# EAGLE design pomodoro (EAGLE 7.7.0)
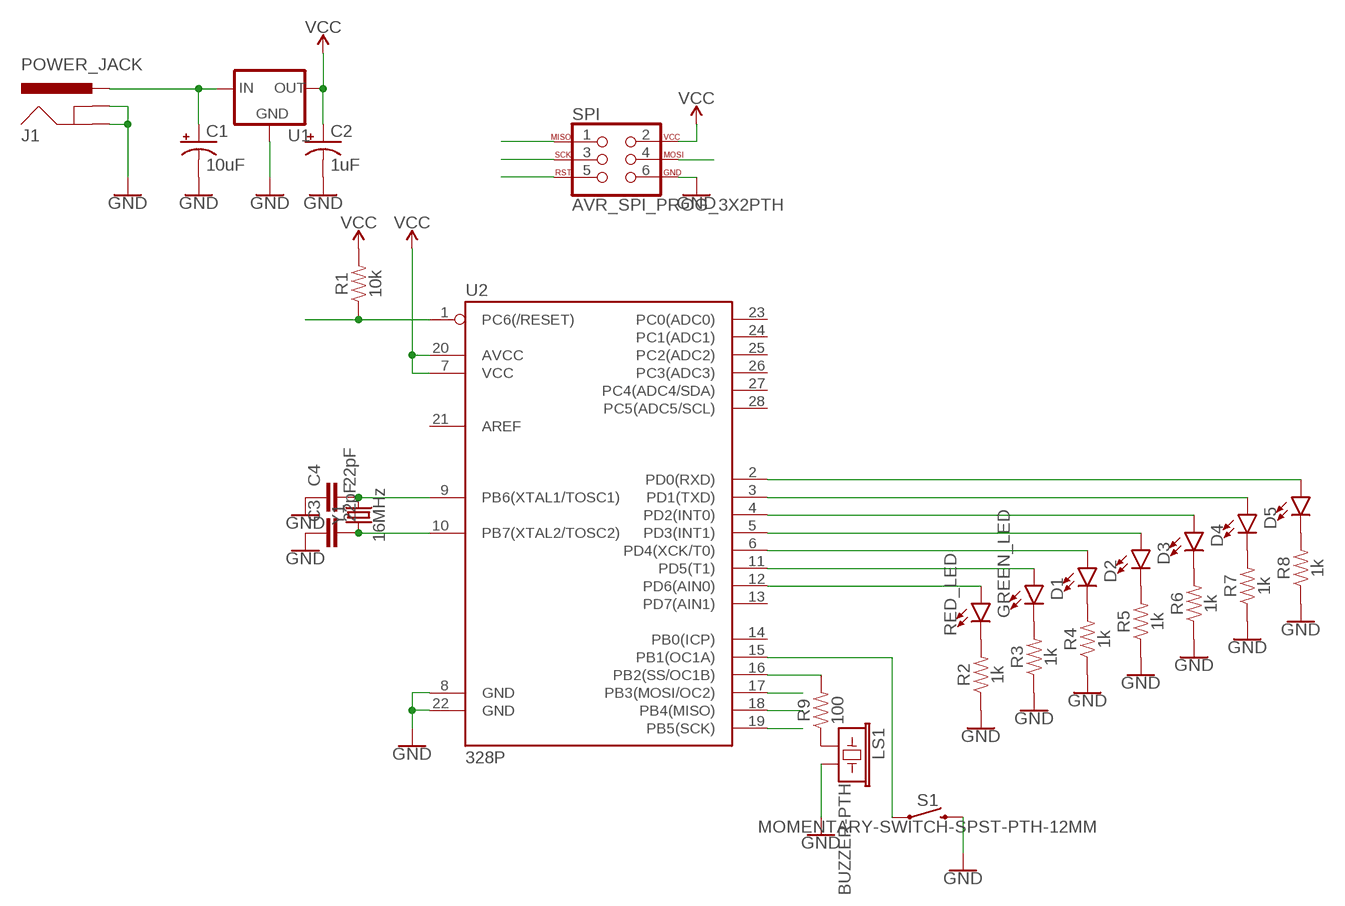
[diagram p0: schematic, sheet 1]

## Parts
C1  10uF  10UF-POLAR-RADIAL-2.5MM-25V-20%  [CPOL-RADIAL-2.5MM-5MM]
C2  1uF  10UF-POLAR-RADIAL-2.5MM-25V-20%  [CPOL-RADIAL-2.5MM-5MM]
C3  22pF  22PF-PTH-2.54MM-200V-5%  [CAP-PTH-2.54]
C4  22pF  22PF-PTH-2.54MM-200V-5%  [CAP-PTH-2.54]
D1  LED5MM  [LED_5MM]
D2  LED5MM  [LED_5MM]
D3  LED5MM  [LED_5MM]
D4  LED5MM  [LED_5MM]
D5  LED5MM  [LED_5MM]
GREEN_LED  LED5MM  [LED_5MM]
J1  POWER_JACK  [POWER_JACK_PTH]
LS1  BUZZER-PTH  [BUZZER-12MM]
R1  10k  1KOHM-HORIZ-1/4W-1%  [AXIAL-0.3]
R2  1k  1KOHM-HORIZ-1/4W-1%  [AXIAL-0.3]
R3  1k  1KOHM-HORIZ-1/4W-1%  [AXIAL-0.3]
R4  1k  1KOHM-HORIZ-1/4W-1%  [AXIAL-0.3]
R5  1k  1KOHM-HORIZ-1/4W-1%  [AXIAL-0.3]
R6  1k  1KOHM-HORIZ-1/4W-1%  [AXIAL-0.3]
R7  1k  1KOHM-HORIZ-1/4W-1%  [AXIAL-0.3]
R8  1k  1KOHM-HORIZ-1/4W-1%  [AXIAL-0.3]
R9  100  1KOHM-HORIZ-1/4W-1%  [AXIAL-0.3]
RED_LED  LED5MM  [LED_5MM]
S1  MOMENTARY-SWITCH-SPST-PTH-12MM  [TACTILE_SWITCH_PTH_12MM]
SPI  AVR_SPI_PROG_3X2PTH  [2X3]
U1  V_REG_78XX-TO-220  [TO-220-ALT]
U2  328P  ATMEGA328P_PDIP  [DIP28]
Y1  16MHz  CRYSTAL-16MHZPTH-HC49US  [HC49US]

## Nets
GND: C1.2(-) C2.2(-) C3.1 C4.1 J1.GND J1.GNDBREAK LS1.- R2.P$1 R3.P$1 R4.P$1 R5.P$1 R6.P$1 R7.P$1 R8.P$1 S1.3 SPI.6 U1.GND U2.8(GND) U2.22(GND)
MISO: SPI.1 U2.18(PB4(MISO))
MOSI: SPI.4 U2.17(PB3(MOSI/OC2))
N$1: R2.P$2 RED_LED.K(C)
N$2: C3.2 U2.10(PB7(XTAL2/TOSC2)) Y1.1
N$3: C4.2 U2.9(PB6(XTAL1/TOSC1)) Y1.2
N$4: GREEN_LED.K(C) R3.P$2
N$5: D1.K(C) R4.P$2
N$6: D2.K(C) R5.P$2
N$7: D3.K(C) R6.P$2
N$8: D4.K(C) R7.P$2
N$9: D5.K(C) R8.P$2
N$10: S1.1 U2.15(PB1(OC1A))
N$11: D5.A U2.2(PD0(RXD))
N$12: D4.A U2.3(PD1(TXD))
N$13: D3.A U2.4(PD2(INT0))
N$14: D2.A U2.5(PD3(INT1))
N$15: D1.A U2.6(PD4(XCK/T0))
N$16: GREEN_LED.A U2.11(PD5(T1))
N$17: RED_LED.A U2.12(PD6(AIN0))
N$18: R9.P$2 U2.16(PB2(SS/OC1B))
N$19: C1.1(+) J1.PWR U1.IN
N$20: LS1.+ R9.P$1
RST: R1.P$1 SPI.5 U2.1(PC6(/RESET))
SCK: SPI.3 U2.19(PB5(SCK))
VCC: C2.1(+) R1.P$2 SPI.2 U1.OUT U2.7(VCC) U2.20(AVCC)
Unconnected: U2.13(PD7(AIN1)) U2.14(PB0(ICP)) U2.21(AREF) U2.23(PC0(ADC0)) U2.24(PC1(ADC1)) U2.25(PC2(ADC2)) U2.26(PC3(ADC3)) U2.27(PC4(ADC4/SDA)) U2.28(PC5(ADC5/SCL))

## Library data of the parts
C1 = SparkFun-Capacitors:10UF-POLAR: 10.0µF polarized capacitors A capacitor is a passive two-terminal electrical component used to store electrical energy temporarily in an electric field.; PROD_ID: CAP-08440
C2 = SparkFun-Capacitors:10UF-POLAR: 10.0µF polarized capacitors A capacitor is a passive two-terminal electrical component used to store electrical energy temporarily in an electric field.; PROD_ID: CAP-08440; VALUE: 10uF
C3 C4 = SparkFun-Capacitors:22PF: 22pF ceramic capacitors A capacitor is a passive two-terminal electrical component used to store electrical energy temporarily in an electric field.; PROD_ID: CAP-09128
D1-D5 GREEN_LED RED_LED = SparkFun-LED:LED: LED (Generic) Standard schematic elements and footprints for 5mm, 3mm, 1206, and 0603 sized LEDs. Generic LEDs with no color specified.
J1 = SparkFun-Connectors:POWER_JACK: Power Jack Connector This is the standard 5.5mm barrel jack for power. The PTH is the most common, proven, reliable, footprint. The Slot footprint only works if the mill layer is transmitted to the PCB fab house so be warned. Here are the connectors we sell at SparkFun: DC Barrel Power Jack/Connector <https://www.sparkfun.com/products/119> (PRT-00119) DC Barrel Power Jack/Connector (SMD) <https://www.sparkfun.com/products/12748> (PRT-12748) DC Barrel Jack Adapter - Breadboard Compatible <https://www.sparkfun.com/products/10811> (PRT-10811) It is used on this SparkFun product (and many, many others): SparkFun RedBoard - Programmed with Arduino <https://www.sparkfun.com/products/12757> (DEV-12757) Also, if you need a mating power supply or connector, please check these out: Wall Adapter Power Supply - 9VDC 650mA <https://www.sparkfun.com/products/298> (TOL-00298) DC Barrel Jack Adapter - Male <https://www.sparkfun.com/products/10287> (PRT-10287); PROD_ID: CONN-08197
LS1 = SparkFun-Electromechanical:BUZZER: Buzzer Small round buzzers that operate around the audible 2kHz range. You can use these as speakers to create simple music or user interfaces. Variant Overview: PTH - Mini Speaker - PC Mount 12mm 2.048kHz <https://www.sparkfun.com/products/7950> PTH_KIT - Mini Speaker - PC Mount 12mm 2.048kHz <https://www.sparkfun.com/products/7950> KIT simplifies soldering by adding stop mask to one side of the pads. PTH_NO_SILK - Mini Speaker - PC Mount 12mm 2.048kHz <https://www.sparkfun.com/products/7950> No silkscreen indicator of buzzer outline. PTH_KIT_NO_SILK - Mini Speaker - PC Mount 12mm 2.048kHz <https://www.sparkfun.com/products/7950> KIT package w/o silkscreen SMD - Buzzer Audio Magnetic (CCV-084B16) SMD buzzer used on, e.g. the LilyPad Buzzer <https://www.sparkfun.com/products/8463> and RFID USB Reader <https://www.sparkfun.com/products/9963>. SMD_KIT - Buzzer Audio Magnetic (CCV-084B16) SMD Buzzer with elongated pins to make soldering easier. Used on the SparkFun Simon Says - Surface Mount Soldering Kit <https://www.sparkfun.com/products/10935>.; PROD_ID: COMP-08253; SF_SKU: COM-07950
R1 R9 = SparkFun-Resistors:1KOHM: 1kΩ resistor A resistor is a passive two-terminal electrical component that implements electrical resistance as a circuit element. Resistors act to reduce current flow, and, at the same time, act to lower voltage levels within circuits. - Wikipedia; PROD_ID: RES-12182; VALUE: 1k
R2-R8 = SparkFun-Resistors:1KOHM: 1kΩ resistor A resistor is a passive two-terminal electrical component that implements electrical resistance as a circuit element. Resistors act to reduce current flow, and, at the same time, act to lower voltage levels within circuits. - Wikipedia; PROD_ID: RES-12182
S1 = SparkFun-Switches:MOMENTARY-SWITCH-SPST: Momentary Switch (Pushbutton) - SPST Normally-open (NO) SPST momentary switches (buttons, pushbuttons). Variants PTH-12MM - 12mm square, through-hole Momentary Pushbutton Switch - 12mm Square <https://www.sparkfun.com/products/9190> (COM-09190) PTH-6.0MM, PTH-6.0MM-KIT - 6.0mm square, through-hole Mini Pushbutton Switch <https://www.sparkfun.com/products/97> (COM-00097) KIT package intended for soldering kit's - only one side of pads' copper is exposed. PTH-RIGHT-ANGLE-KIT - Right-angle, through-hole Right Angle Tactile Button <https://www.sparkfun.com/products/10791> - Used on SparkFun BigTime Watch Kit <https://www.sparkfun.com/products/11734> SMD-12MM - 12mm square, surface-mount Tactile Button - SMD (12mm) <https://www.sparkfun.com/products/12993> (COM-12993) Used on SparkFun PicoBoard <https://www.sparkfun.com/products/11888> SMD-4.5MM - 4.5mm Square Trackball Switch Used on SparkFun Blackberry Trackballer Breakout <https://www.sparkfun.com/products/13169> SMD-4.6MMX2.8MM - 4.60mm x 2.80mm, surface mount Used on SparkFun SAMD21 Mini Breakout <https://www.sparkfun.com/products/13664> SMD-5.2MM, SMD-5.2-REDUNDANT - 5.2mm square, surface-mount Mini Pushbutton Switch - SMD <https://www.sparkfun.com/products/8720> (COM-08720) Used on Arduino Pro Mini <https://www.sparkfun.com/products/11114> REDUNDANT package connects both switch circuits together SMD-6.0X3.5MM - 6.0 x 3.5mm, surface mount Momentary Reset Switch SMD <https://www.sparkfun.com/products/8229> (COM-08229) SMD-6.2MM-TALL - 6.2mm square, surface mount Tactile Button - SMD (6mm) <https://www.sparkfun.com/products/12992> Used on SparkFun Digital Sandbox <https://www.sparkfun.com/products/12651> SMD-RIGHT-ANGLE - Right-angle, surface mount Used on SparkFun Block for Intel® Edison - Arduino <https://www.sparkfun.com/products/13036>; PROD_ID: SWCH-09185; SF_SKU: COM-09190
SPI = SparkFun-Connectors:AVR_SPI_PROG_3X2: AVR ISP 6 Pin This is the reduced ISP connector for AVR programming. Common on Arduino. This footprint will take up less PCB space and can be used with a 10-pin to 6-pin adapter such as SKU: BOB-08508 **Special note about "TEST_POINT" package. The stop mask is on the top side, so if you want your programming test points to be on the bottom of your board, make sure to place this package on the bottom side of the board. This also ensure that the orientation to program from the bottom side will be correct. SparkFun Products: SparkFun ISP Pogo Adapter <https://www.sparkfun.com/products/11591> - NS Tiny AVR Programmer <https://www.sparkfun.com/products/11801> -PTH
U1 = SparkFun-IC-Power:V_REG_78XX: Voltage Regulator Standard 78xx regulator. IGO (Input Ground Output). Spark Fun Electronics SKU : COM-00107; PROD_ID: VREG-08450; SF_ID: COM-00107
U2 = SparkFun-IC-Microcontroller:ATMEGA328P_PDIP: Atmel 328P Through hole ATMEGA328P uC used in the Arduino 32kb flash, 1k EEPROM, 2k SRAM Datasheet <http://www.sparkfun.com/datasheets/Components/SMD/ATMega328.pdf> SparkFun Products Storefront component: AVR 28 Pin 20MHz 32K 6A/D - ATMega328P <https://www.sparkfun.com/products/9061> (COM-09061) SparkFun Simon Says - Through-Hole Soldering Kit <https://www.sparkfun.com/products/10547> (KIT-10547) SparkFun Learn to Solder - Simon Says <https://www.sparkfun.com/products/13708> (KIT-13708) SparkFun BigTime Watch Kit <https://www.sparkfun.com/products/11734> (KIT-11734) SparkFun ClockIt <https://www.sparkfun.com/products/10930> (KIT-10930) SparkFun Serial Enabled LCD Kit <https://www.sparkfun.com/products/10097> (LCD-10097) SparkFun Simon Tilts - Through Hole Soldering Kit <https://www.sparkfun.com/products/12634> (KIT-12634) SparkFun Frequency Counter Kit <https://www.sparkfun.com/products/10140> (KIT-10140) FabFM Radio Kit <https://www.sparkfun.com/products/11043> (KIT-11043) SparkFun Binary Blaster Kit <https://www.sparkfun.com/products/12037> (KIT-12037) SparkFun Metro-Gnome <https://www.sparkfun.com/products/9236> (KIT-09236) ATmega328 with Arduino Optiboot (Uno) <https://www.sparkfun.com/products/10524> (DEV-10524); PROD_ID: IC-09136
Y1 = SparkFun-Clocks:CRYSTAL-16MHZ: 16MHz Crystal Digikey Example <http://www.digikey.com/product-search/en?keywords=535-9122-1-ND> Frequency: 16MHz Frequency Stability: ±50ppm Frequency Tolerance: ±20ppm Load Capacitance: 18pF SparkFun Products: Pro Micro -5V/16MHz <https://www.sparkfun.com/products/12640> SparkFun Serial Enabled LCD Kit <https://www.sparkfun.com/products/10097>; PROD_ID: XTAL-08181; SF_ID: COM-00536

## Board
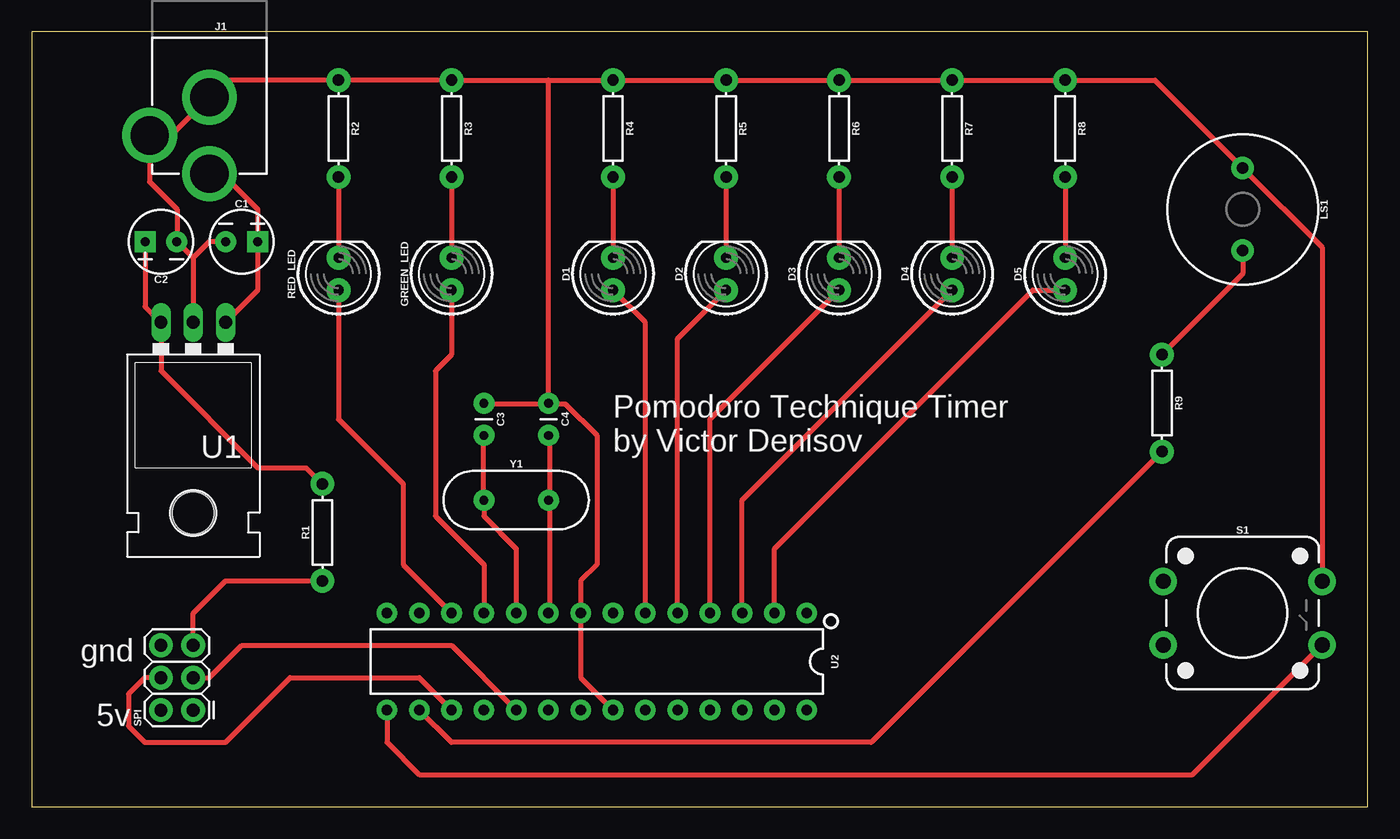
[diagram p1: board, top side]
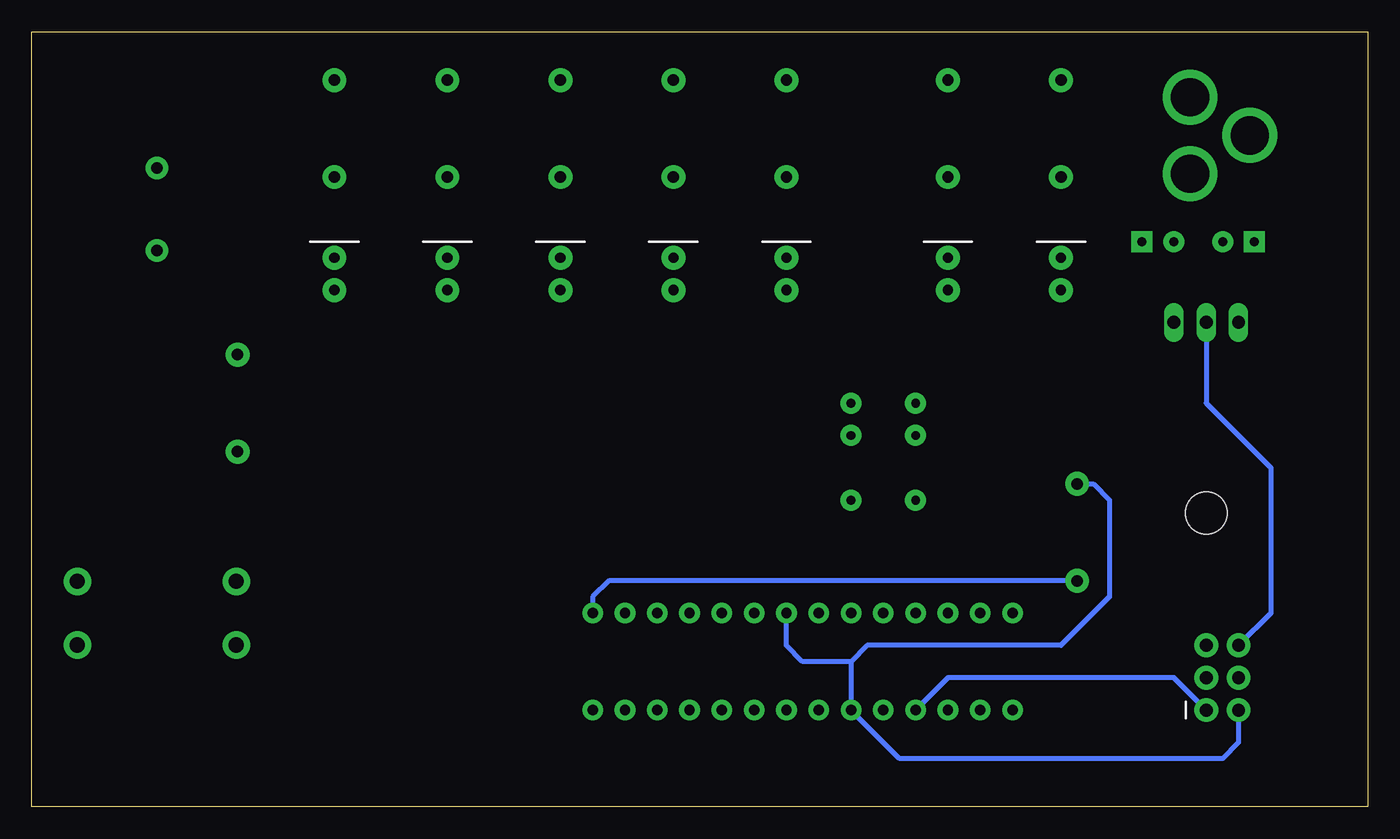
[diagram p2: board, bottom side, seen from below]

Size 105.08 x 60.95 mm. Coordinates in mm from the lower left corner, seen from the top.
Outline: 0,0 105.08,0 105.08,60.95 0,60.95 0,0
Copper layers (1*16): Top 0.035mm / dielectric 1.5mm / Bottom 0.035mm
Design rules "default": minimum track width 10mil, minimum drill 24mil, track to track 8mil, track to pad 8mil, pad to pad 8mil, via to via 8mil, smd to smd 8mil, copper to edge 40mil, drill to drill 8mil, minimum pad ring 10mil, minimum via ring 8mil, stop-mask expansion 4mil, vias tented up to drill 0mil, thermal gap 10mil

### Footprints (pad centres in the part's own frame; a part is rotated, then mirrored left to right if it is on the bottom)
CPOL-RADIAL-2.5MM-5MM = drill 0.7 pad 1.651 square: 1 1.25,0 | drill 0.7 pad 1.651: 2 -1.25,0
CAP-PTH-2.54 = drill 0.7 pad 1.651: 1 -1.27,0; 2 1.27,0
LED_5MM = drill 0.813 pad 1.88: A -1.27,0; K 1.27,0
POWER_JACK_PTH = drill 2.997 pad 4.318: GND 0,7.7; GNDBREAK 4.7,10.7; PWR 0,13.7
BUZZER-12MM = drill 0.9 pad 1.778: + 3.25,0; - -3.25,0
AXIAL-0.3 = drill 0.9 pad 1.88: P$1 -3.81,0; P$2 3.81,0
TACTILE_SWITCH_PTH_12MM = drill 1.2 pad 2.159: 1 6.25,-2.5; 2 -6.25,-2.5; 3 6.25,2.5; 4 -6.25,2.5
2X3 = drill 1.016 pad 1.88: 1 0,0; 2 0,2.54; 3 2.54,0; 4 2.54,2.54; 5 5.08,0; 6 5.08,2.54
TO-220-ALT = drill 1.016 long: GND 0,-3.81; IN -2.54,-3.81; OUT 2.54,-3.81 | hole 3.302: 0,11.176
DIP28 = drill 0.813 pad 1.626: 1 -16.51,-3.81; 2 -13.97,-3.81; 3 -11.43,-3.81; 4 -8.89,-3.81; 5 -6.35,-3.81; 6 -3.81,-3.81; 7 -1.27,-3.81; 8 1.27,-3.81; 9 3.81,-3.81; 10 6.35,-3.81; 11 8.89,-3.81; 12 11.43,-3.81; 13 13.97,-3.81; 14 16.51,-3.81; 15 16.51,3.81; 16 13.97,3.81; 17 11.43,3.81; 18 8.89,3.81; 19 6.35,3.81; 20 3.81,3.81; 21 1.27,3.81; 22 -1.27,3.81; 23 -3.81,3.81; 24 -6.35,3.81; 25 -8.89,3.81; 26 -11.43,3.81; 27 -13.97,3.81; 28 -16.51,3.81
HC49US = drill 0.7 pad 1.651: 1 -2.54,0; 2 2.54,0

### Placement (x,y rotation side)
C1  16.51,44.45 0 top
C2  10.16,44.45 180 top
C3  35.56,30.48 270 top
C4  40.64,30.48 270 top
D1  45.72,41.91 90 top
D2  54.61,41.91 90 top
D3  63.5,41.91 90 top
D4  72.39,41.91 90 top
D5  81.28,41.91 90 top
GREEN_LED  33.02,41.91 90 top
J1  13.97,63.5 180 top
LS1  95.25,46.99 270 top
R1  22.86,21.59 90 top
R2  24.13,53.34 270 top
R3  33.02,53.34 270 top
R4  45.72,53.34 270 top
R5  54.61,53.34 270 top
R6  63.5,53.34 270 top
R7  72.39,53.34 270 top
R8  81.28,53.34 270 top
R9  88.9,31.75 270 top
RED_LED  24.13,41.91 90 top
S1  95.25,15.24 0 top
SPI  12.7,7.62 90 top
U1  12.7,34.29 180 top
U2  44.45,11.43 180 top
Y1  38.1,24.13 0 top

### Tracks (layer width: path | path; a pad name or v marks a point on that pad's centre or on a via)
GND
  Top 0.254: 35.71,31.7 C3.1 35.48,31.93 | 40.51,31.7 C4.1 | 13.77,55.7 J1.GND | 11.25,44.5 C2.2
  Top 0.406: 40.51,31.7 41.96,31.7 44.45,29.21 44.45,19.05 43.18,17.78 U2.8 43.18,10.16 U2.22 | 40.64,57.15 R3.P$1 R2.P$1 15.32,57.15 J1.GND 10.97,52.8 J1.GNDBREAK 9.27,49.15 11.43,46.99 11.43,44.47 C2.2 11.43,44.45 12.7,43.18 | 40.64,57.15 R4.P$1 R5.P$1 R6.P$1 R7.P$1 R8.P$1 88.34,57.15 LS1.- 101.5,43.99 S1.3 | 40.64,57.15 C4.1 40.59,31.7 35.71,31.7 | 12.7,43.18 U1.GND | C1.2 13.97,44.45 12.7,43.18
  Bottom 0.406: U1.GND 12.7,31.75 7.62,26.67 7.62,15.24 SPI.6
MISO
  Bottom 0.406: SPI.1 15.24,10.16 33.02,10.16 U2.18
MOSI
  Top 0.406: SPI.4 8.89,10.16 7.62,8.89 7.62,6.35 8.89,5.08 15.24,5.08 20.32,10.16 30.48,10.16 U2.17
N$1
  Top 0.406: R2.P$2 RED_LED.K
N$2
  Top 0.254: 35.48,29.18 C3.2 | 35.48,24.15 Y1.1
  Top 0.406: U2.10 38.1,20.32 35.56,22.86 Y1.1 35.48,24.21 35.48,29.18
N$3
  Top 0.254: 40.74,15.24 U2.9 | 40.74,23.93 Y1.2 40.74,24.15 | 40.74,29.18 C4.2
  Top 0.406: 40.74,23.93 40.74,15.34 U2.9 | 40.74,29.18 40.74,24.23 Y1.2
N$4
  Top 0.406: R3.P$2 GREEN_LED.K
N$5
  Top 0.406: R4.P$2 D1.K
N$6
  Top 0.406: R5.P$2 D2.K
N$7
  Top 0.406: R6.P$2 D3.K
N$8
  Top 0.406: R7.P$2 D4.K
N$9
  Top 0.406: R8.P$2 D5.K
N$10
  Top 0.406: U2.15 27.94,5.08 30.48,2.54 91.3,2.54 S1.1
N$11
  Top 0.406: U2.2 58.42,20.32 78.74,40.64 D5.A
N$12
  Top 0.406: U2.3 55.88,24.13 D4.A
N$13
  Top 0.406: U2.4 53.34,30.48 D3.A
N$14
  Top 0.406: U2.5 50.8,36.83 D2.A
N$15
  Top 0.406: U2.6 48.26,38.1 D1.A
N$16
  Top 0.406: GREEN_LED.A 33.02,35.56 31.75,34.29 31.75,22.86 35.56,19.05 U2.11
N$17
  Top 0.406: RED_LED.A 24.13,30.48 29.21,25.4 29.21,19.05 U2.12
N$18
  Top 0.406: R9.P$2 66.04,5.08 33.02,5.08 U2.16
N$19
  Top 0.406: J1.PWR 14.97,49.8 17.78,46.99 17.78,44.47 C1.1 17.76,40.62 U1.IN
N$20
  Top 0.406: LS1.+ 95.25,41.91 R9.P$1
RST
  Top 0.406: SPI.5 12.7,15.24 15.24,17.78 R1.P$1
  Bottom 0.406: R1.P$1 59.69,17.78 60.96,16.51 U2.1
SCK
  Top 0.406: SPI.3 13.97,10.16 16.51,12.7 33.02,12.7 U2.19
VCC
  Top 0.406: C2.1 8.91,39.35 U1.OUT 10.16,34.29 17.78,26.67 21.59,26.67 R1.P$2
  Bottom 0.406: SPI.2 10.16,5.08 11.43,3.81 36.83,3.81 U2.20 40.64,11.43 | R1.P$2 21.59,25.4 20.32,24.13 20.32,16.51 24.13,12.7 39.37,12.7 40.64,11.43 | 40.64,11.43 44.45,11.43 45.72,12.7 U2.7

### Text on the board
tPlace: Pomodoro Technique Timer / by Victor Denisov | gnd | 5v